# Altium schematic sheet Sheet1.SchDoc
size A
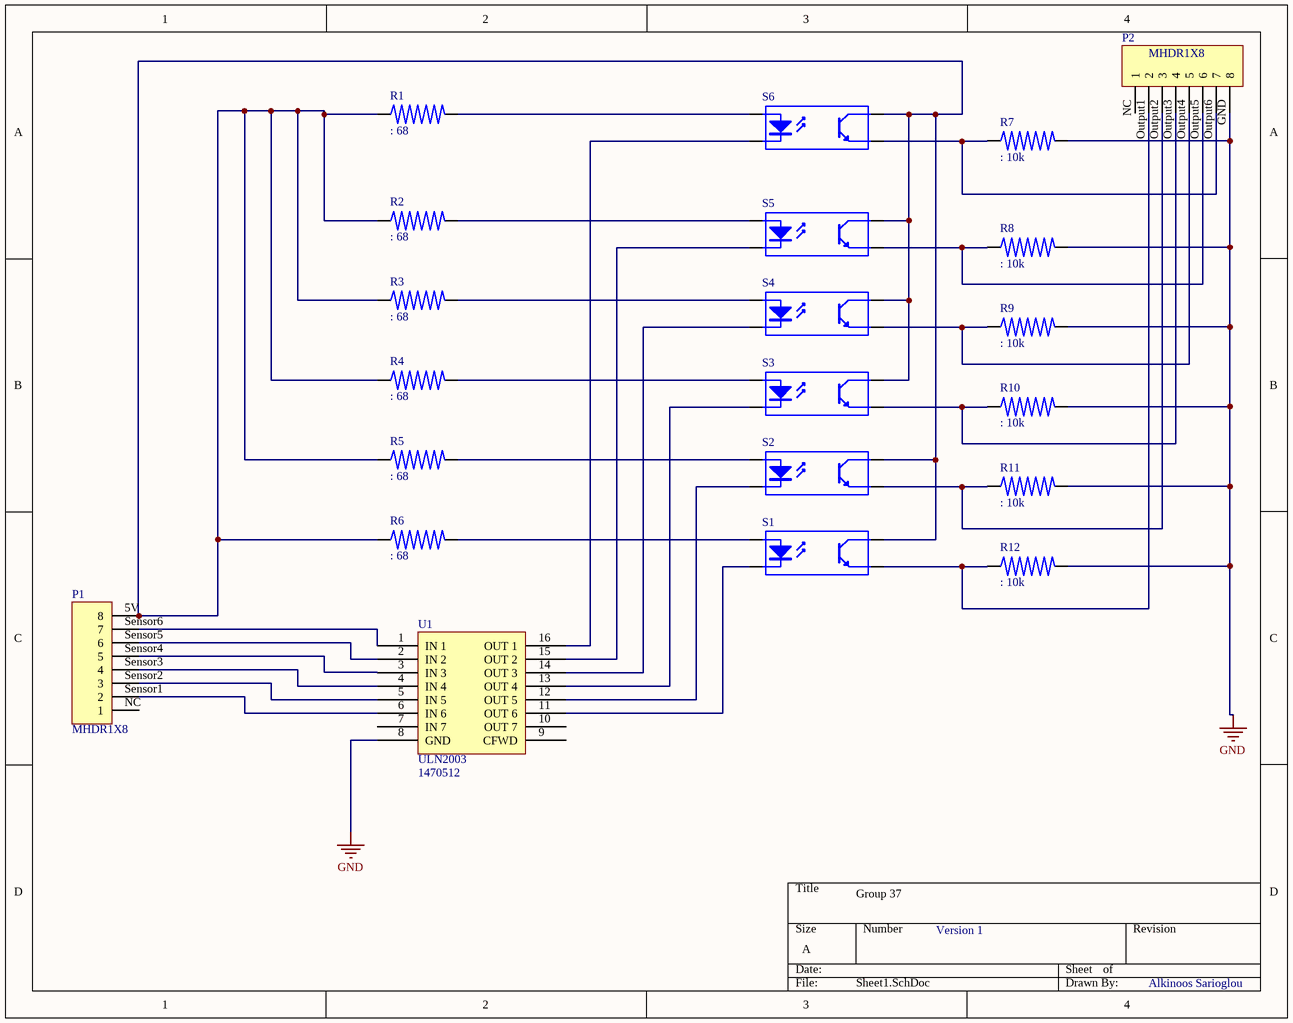
[diagram p0: Sheet1.SchDoc]

## Parts
P1  MHDR1X8  [MHDR1X8]
P2  MHDR1X8  [MHDR1X8]
R1  Resistor (IO board)  [RESISTOR_10K_TH_QW]  (value not drawn)
R2  Resistor (IO board)  [RESISTOR_10K_TH_QW]  (value not drawn)
R3  Resistor (IO board)  [RESISTOR_10K_TH_QW]  (value not drawn)
R4  Resistor (IO board)  [RESISTOR_10K_TH_QW]  (value not drawn)
R5  Resistor (IO board)  [RESISTOR_10K_TH_QW]  (value not drawn)
R6  Resistor (IO board)  [RESISTOR_10K_TH_QW]  (value not drawn)
R7  Resistor (IO board)  [RESISTOR_10K_TH_QW]  (value not drawn)
R8  Resistor (IO board)  [RESISTOR_10K_TH_QW]  (value not drawn)
R9  Resistor (IO board)  [RESISTOR_10K_TH_QW]  (value not drawn)
R10  Resistor (IO board)  [RESISTOR_10K_TH_QW]  (value not drawn)
R11  Resistor (IO board)  [RESISTOR_10K_TH_QW]  (value not drawn)
R12  Resistor (IO board)  [RESISTOR_10K_TH_QW]  (value not drawn)
S1  TCRT5000(On PCB)  [TCRT5000 Breakout]  (value not drawn)
S2  TCRT5000(On PCB)  [TCRT5000 Breakout]  (value not drawn)
S3  TCRT5000(On PCB)  [TCRT5000 Breakout]  (value not drawn)
S4  TCRT5000(On PCB)  [TCRT5000 Breakout]  (value not drawn)
S5  TCRT5000(On PCB)  [TCRT5000 Breakout]  (value not drawn)
S6  TCRT5000(On PCB)  [TCRT5000 Breakout]  (value not drawn)
U1  ULN2003  Supplier Part Number 1: 1470512  [DILP-16(300) - 3D]

## Nets
GND: P2.GND(8) R7.2 R8.2 R9.2 R10.2 R11.2 R12.2 U1.8(GND)
NetP1_5V: P1.5V(8) R1.1 R2.1 R3.1 R4.1 R5.1 R6.1 S1.4(C) S2.4(C) S3.4(C) S4.4(C) S5.4(C) S6.4(C)
NetP1_Sensor1: P1.Sensor1(2) U1.6(IN_6)
NetP1_Sensor2: P1.Sensor2(3) U1.5(IN_5)
NetP1_Sensor3: P1.Sensor3(4) U1.4(IN_4)
NetP1_Sensor4: P1.Sensor4(5) U1.3(IN_3)
NetP1_Sensor5: P1.Sensor5(6) U1.2(IN_2)
NetP1_Sensor6: P1.Sensor6(7) U1.1(IN_1)
NetP2_Output1: P2.Output1(2) R12.1 S1.3(E)
NetP2_Output2: P2.Output2(3) R11.1 S2.3(E)
NetP2_Output3: P2.Output3(4) R10.1 S3.3(E)
NetP2_Output4: P2.Output4(5) R9.1 S4.3(E)
NetP2_Output5: P2.Output5(6) R8.1 S5.3(E)
NetP2_Output6: P2.Output6(7) R7.1 S6.3(E)
NetR1_2: R1.2 S6.1(A)
NetR2_2: R2.2 S5.1(A)
NetR3_2: R3.2 S4.1(A)
NetR4_2: R4.2 S3.1(A)
NetR5_2: R5.2 S2.1(A)
NetR6_2: R6.2 S1.1(A)
NetS1_2: S1.2(K) U1.11(OUT_6)
NetS2_2: S2.2(K) U1.12(OUT_5)
NetS3_2: S3.2(K) U1.13(OUT_4)
NetS4_2: S4.2(K) U1.14(OUT_3)
NetS5_2: S5.2(K) U1.15(OUT_2)
NetS6_2: S6.2(K) U1.16(OUT_1)

Not connected (* = marked no-connect by the designer): P1 NC(1); P2 NC(1); U1 7(IN_7) 9(CFWD) 10(OUT_7)

## Notes on the sheet
- Group 37
- Version 1
- Alkinoos Sarioglou
- (in symbol Resistor(IO board)) 68; 10k

## Library data of the parts
P1 P2 = MHDR1X8: Header, 8-Pin; LatestRevisionDate: 17-Jul-2002; LatestRevisionNote: Re-released for DXP Platform.; Publisher: Altium Limited
R1-R12 = Resistor(IO board): Resistor (SFR25); Supplier: *; Part Number: *
S1-S6 = TCRT5000(On PCB): 4-Pin Phototransistor Optocoupler; pin to pad: 1>2 2>7 3>6 4>3; Published: 24-Mar-1999; LatestRevisionDate: 04-Mar-2005; LatestRevisionNote: Sch pins 3 & 4 Swapped.; DatasheetVersion: Nov-2003; PackageReference: DIP-4; Publisher: Altium Limited
  S4 S6: Supplier 1: Farnell; Supplier Part Number 1: 1470066
U1 = ULN2003: Darlington Transistor Array; Supplier 1: Farnell